# EAGLE design femtoBeacon_coin_nRF52832_BT4.2_r1.0.0 (EAGLE 7.5.0)

## Sheet 1 of 2
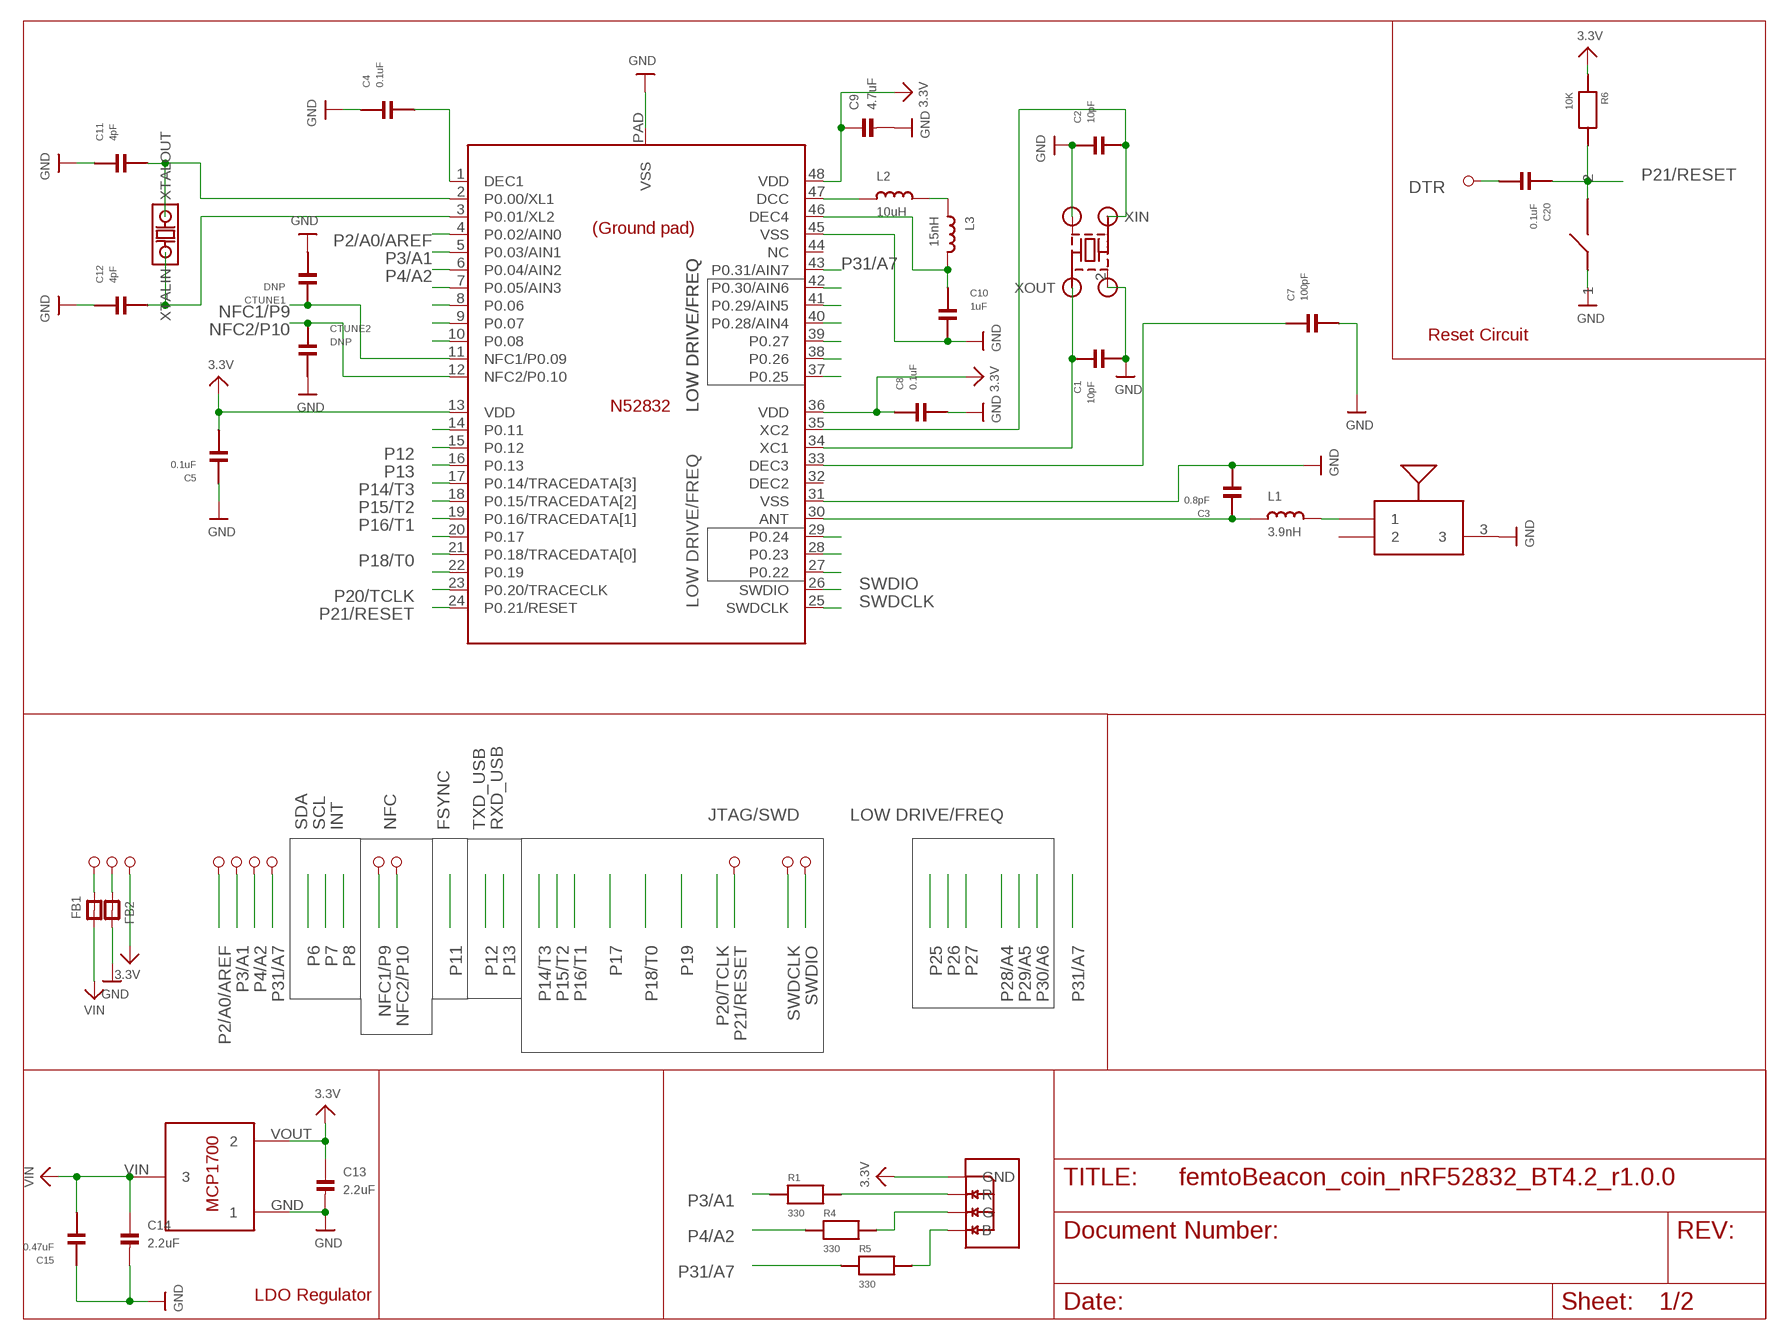
[diagram p0: schematic, sheet 1]

### Parts
ANTBAR  PULSE_ANT_2.4GHZ  [ANT_BAR]
C1  10pF  CAPACITOR_0201  [PART]
C2  10pF  CAPACITOR_0201  [PART]
C3  0.8pF  CAPACITOR_0201  [PART]
C4  0.1uF  CAPACITOR_0201  [PART]
C5  0.1uF  CAPACITOR_0201  [PART]
C7  100pF  CAPACITOR_0201  [PART]
C8  0.1uF  CAPACITOR_0201  [PART]
C9  4.7uF  CAP_CERAMIC_0402MP  [_0402MP]
C10  1uF  CAPACITOR_0201  [PART]
C11  4pF  CAPACITOR_0201  [PART]
C12  4pF  CAPACITOR_0201  [PART]
C13  2.2uF  CAP_CERAMIC_0402MP  [_0402MP]
C14  2.2uF  CAP_CERAMIC_0402MP  [_0402MP]
C15  0.47uF  CAPACITOR_0201  [PART]
C20  0.1uF  CAPACITOR_0201  [PART]
CTUNE1  DNP  CAPACITOR_0201  [PART]
CTUNE2  DNP  CAPACITOR_0201  [PART]
FB1  FERRITE_0603MP  [_0603MP]
FB2  FERRITE_0603MP  [_0603MP]
IC1  NRF52832_QFN48  [QFN48]
L1  3.9nH  INDUCTOR_0402MP  [_0402MP]
L2  10uH  INDUCTOR_0603MP  [_0603MP]
L3  15nH  INDUCTOR_0402MP  [_0402MP]
LDO_VREG  MCP1700T-3302E/TT  [MCP1700T-3302E/TT]
LED1  LRTB_R48G  [LRTB_R48G]
PIN1  1X1_ROUND  [1X1_ROUND]
PIN2  1X1_ROUND  [1X1_ROUND]
PIN3  1X1_ROUND  [1X1_ROUND]
PIN4  1X1_ROUND  [1X1_ROUND]
PIN7  1X1_ROUND  [1X1_ROUND]
PIN8  1X1_ROUND  [1X1_ROUND]
PIN9  1X1_ROUND  [1X1_ROUND]
PIN10  1X1_ROUND  [1X1_ROUND]
PIN13  1X1_ROUND  [1X1_ROUND]
PIN14  1X1_ROUND  [1X1_ROUND]
PIN25  1X1_ROUND  [1X1_ROUND]
PIN26  1X1_ROUND  [1X1_ROUND]
PIN27  1X1_ROUND  [1X1_ROUND]
R1  330  RESISTOR_0201  [PART]
R4  330  RESISTOR_0201  [PART]
R5  330  RESISTOR_0201  [PART]
R6  10K  RESISTOR_0201  [PART]
RESET_JMP  SPST_SMD  [SPST_SMD]
XOSC32K  ABS06-107-32.768KHZ-T  [ABS06-107-32.768KHZ-T]
XTAL  32MHz  ABM11-48.000MHZ-D2X-T3  [ABM11]

### Nets
3.3V: C5.2 C8.1 C9.1 C13.1 IC1.13(VDD) IC1.36(VDD) IC1.48(VDD) LDO_VREG.VOUT LED1.1(GND) PIN3.P$1 R6.1 ; also sheet 2
B: LED1.4(B) R5.2
DTR: C20.2 PIN4.P$1
G: LED1.3(G) R4.2
GND: ANTBAR.3 C1.2 C2.1 C3.2 C4.1 C5.1 C7.2 C8.2 C9.2 C10.2 C11.1 C12.1 C13.2 C14.2 C15.1 CTUNE1.2 CTUNE2.2 FB2.2 IC1.31(VSS) IC1.45(VSS) IC1.PAD(VSS) LDO_VREG.GND RESET_JMP.1 XTAL.2(GND) XTAL.4(GND) ; also sheet 2
N$1: C4.2 IC1.1(DEC1)
N$2: L2.2 L3.1
N$3: IC1.47(DCC) L2.1
N$4: C7.1 IC1.33(DEC3)
N$5: FB2.1 PIN2.P$1
N$6: C10.1 IC1.46(DEC4) L3.2
N$8: FB1.2 PIN1.P$1
N$13: C3.1 IC1.30(ANT) L1.1
NFC1/P9: CTUNE1.1 IC1.11(NFC1/P0.09) PIN13.P$1
NFC2/P10: CTUNE2.1 IC1.12(NFC2/P0.10) PIN14.P$1
P0/XIN32: C11.2 IC1.2(P0.00/XL1) XOSC32K.2(XTALOUT)
P1/XOUT32: C12.2 IC1.3(P0.01/XL2) XOSC32K.1(XTALIN)
P2/A0/AREF: IC1.4(P0.02/AIN0) PIN9.P$1
P3/A1: IC1.5(P0.03/AIN1) PIN10.P$1 R1.1
P4/A2: IC1.6(P0.04/AIN2) PIN7.P$1 R4.1
P5/A3: IC1.7(P0.05/AIN3)
P6: IC1.8(P0.06) ; also sheet 2
P7: IC1.9(P0.07) ; also sheet 2
P8: IC1.10(P0.08) ; also sheet 2
P11: IC1.14(P0.11) ; also sheet 2
P12: IC1.15(P0.12)
P13: IC1.16(P0.13)
P14/T3: IC1.17(P0.14/TRACEDATA[3])
P15/T2: IC1.18(P0.15/TRACEDATA[2])
P16/T1: IC1.19(P0.16/TRACEDATA[1])
P17: IC1.20(P0.17)
P18/T0: IC1.21(P0.18/TRACEDATA[0])
P19: IC1.22(P0.19)
P20/TCLK: IC1.23(P0.20/TRACECLK)
P21/RESET: C20.1 IC1.24(P0.21/RESET) PIN25.P$1 R6.2 RESET_JMP.2
P22: IC1.27(P0.22)
P23: IC1.28(P0.23)
P24: IC1.29(P0.24)
P25: IC1.37(P0.25)
P26: IC1.38(P0.26)
P27: IC1.39(P0.27)
P28/A4: IC1.40(P0.28/AIN4)
P29/A5: IC1.41(P0.29/AIN5)
P30/A6: IC1.42(P0.30/AIN6)
P31/A7: IC1.43(P0.31/AIN7) PIN8.P$1 R5.1
R: LED1.2(R) R1.2
RF: ANTBAR.1 L1.2
SWDCLK: IC1.25(SWDCLK) PIN26.P$1
SWDIO: IC1.26(SWDIO) PIN27.P$1
VIN: C14.1 C15.2 FB1.1 LDO_VREG.VIN
XIN: C1.1 IC1.34(XC1) XTAL.3(XOUT)
XOUT: C2.2 IC1.35(XC2) XTAL.1(XIN)
Unconnected: ANTBAR.2 IC1.32(DEC2) IC1.44(NC)

### Notes on the sheet
- Reset Circuit
- LOW DRIVE/FREQ | LOW DRIVE/FREQ
- LOW DRIVE/FREQ
- JTAG/SWD | LOW DRIVE/FREQ
- SDA | SCL | INT | NFC | FSYNC | TXD_USB | RXD_USB
- LDO Regulator

## Sheet 2 of 2
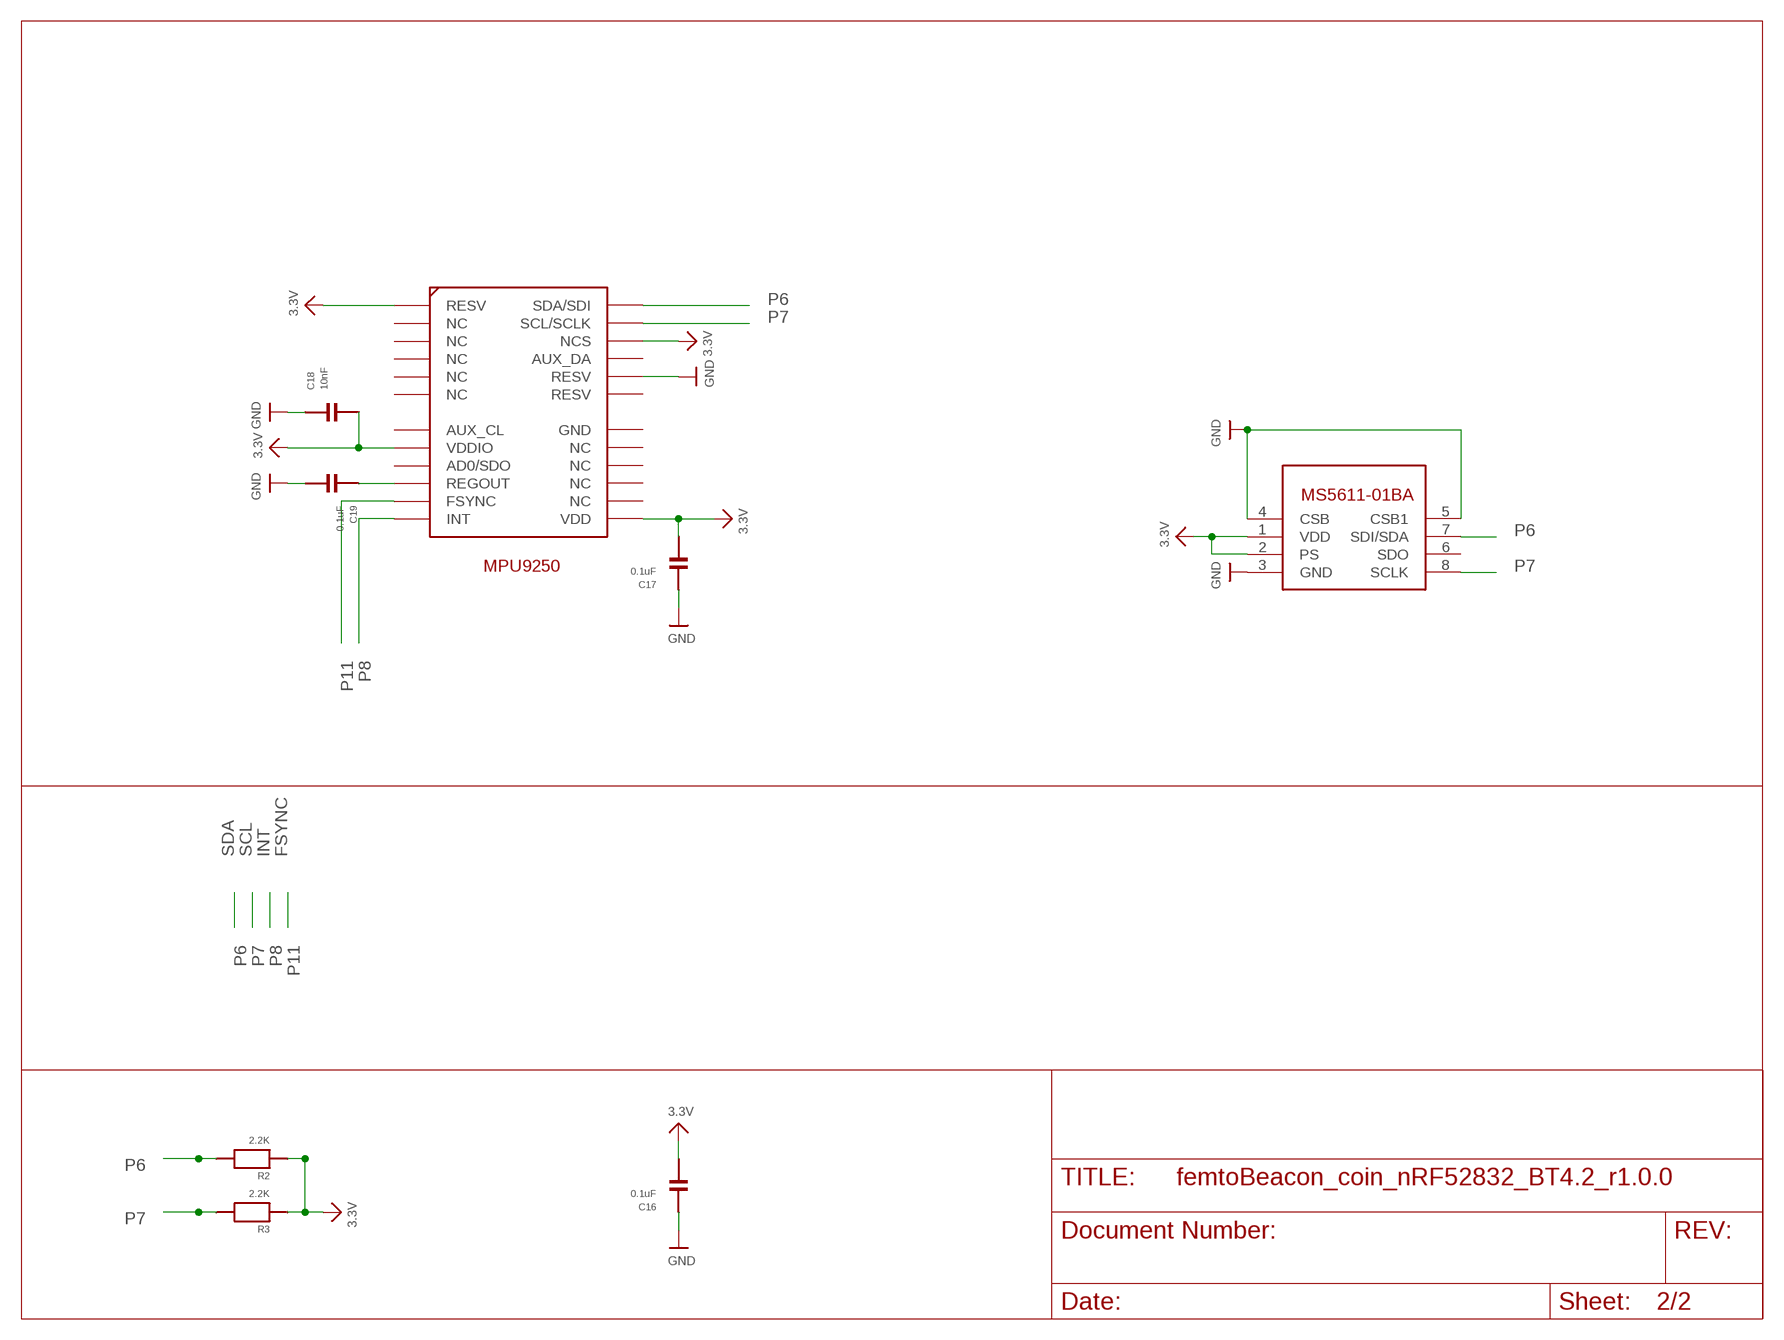
[diagram p1: schematic, sheet 2]

### Parts
BARO1  MS5611-01BA03  [MS5611-01BA03]
C16  0.1uF  CAPACITOR_0201  [PART]
C17  0.1uF  CAPACITOR_0201  [PART]
C18  10nF  CAPACITOR_0201  [PART]
C19  0.1uF  CAPACITOR_0201  [PART]
IMU1  MPU-9250  [QFN_3X3MM]
R2  2.2K  RESISTOR_0201  [PART]
R3  2.2K  RESISTOR_0201  [PART]

### Nets
3.3V: BARO1.1(VDD) BARO1.2(PS) C16.2 C17.2 C18.2 IMU1.P$1(RESV) IMU1.P$8(VDDIO) IMU1.P$13(VDD) IMU1.P$22(NCS) R2.1 R3.1 ; also sheet 1
GND: BARO1.3(GND) BARO1.4(CSB) BARO1.5(CSB1) C16.1 C17.1 C18.1 C19.2 IMU1.P$20(RESV) ; also sheet 1
P6: BARO1.7(SDI/SDA) IMU1.P$24(SDA/SDI) R2.2 ; also sheet 1
P7: BARO1.8(SCLK) IMU1.P$23(SCL/SCLK) R3.2 ; also sheet 1
P8: IMU1.P$12(INT) ; also sheet 1
P11: IMU1.P$11(FSYNC) ; also sheet 1
REGOUT: C19.1 IMU1.P$10(REGOUT)
Unconnected: BARO1.6(SDO) IMU1.P$2(NC) IMU1.P$3(NC) IMU1.P$4(NC) IMU1.P$5(NC) IMU1.P$6(NC) IMU1.P$7(AUX_CL) IMU1.P$9(AD0/SDO) IMU1.P$14(NC) IMU1.P$15(NC) IMU1.P$16(NC) IMU1.P$17(NC) IMU1.P$18(GND) IMU1.P$19(RESV) IMU1.P$21(AUX_DA)

### Notes on the sheet
- MPU9250
- SDA | SCL | INT | FSYNC

## Library data of the parts
ANTBAR = bar_antenna:PULSE_ANT_2.4GHZ: Manufacturer part #W3008; MFR_ID: W3008
BARO1 = freeimu:MS5611-01BA03; MFR_ID: MS561101BA03-50
C1 C2 = parts_0201:CAPACITOR_0201; MFR_ID: GRM0335C1E100GA01D; TOL: NP0, 2%
C3 = parts_0201:CAPACITOR_0201; MFR_ID: GJM0335C1ER80BB01D; TOL: NP0, 5%
C4 C5 C8 C16 C17 C19 C20 = parts_0201:CAPACITOR_0201; MFR_ID: GRM033C80J104KE84D
C7 = parts_0201:CAPACITOR_0201; MFR_ID: C0201C101J3GACTU; TOL: NP0, 5%
C9 = microbuilder:CAP_CERAMIC: Ceramic Capacitors 0402 - 0402 Surface Mount Capacitors 16pF 50V 5% [Digikey: 445-4899-2-ND] 18pF 50V 5% [Digikey: 490-1281-2-ND] 22pF 50V 5% [Digikey: 490-1283-2-ND] 68pF 50V 5% [Digikey: 490-1289-2-ND] 0.1uF 10V 10% [Digikey: 490-1318-2-ND] 1.0uF 6.3V 10% [Digikey: 490-1320-2-ND] 0603 - 0603 Surface Mount Capacitors 16 pF 50V 5% [Digikey: 445-5051-2-ND] 22 pF 50V [Digikey: PCC220ACVTR-ND] 33 pF 50V 5% [Digikey: 490-1415-1-ND] 56pF 50V 5% [Digikey: 490-1421-1-ND] 220pF 50V 5% [Digikey: 445-1285-1-ND] 680 pF 50V 2200 pF 50V 5% C0G [Digikey: 445-1297-1-ND] 5600 pF 100V 5% X7R [Digikey: 478-3711-1-ND] 0.1 µF 25V 10% [Digikey: PCC2277TR-ND] 0.22 µF 16V 10% X7R [Digikey: 445-1318-1-ND] 1.0 µF 25V 10% [Digikey: 445-5146-2-ND] 0603 - RF Specific 3pF 250V +/-0.1pF RF [Digikey: 712-1347-1-ND] 18 pF 250V 5% [Digikey: 478-3505-1-ND or 712-1322-1-ND] 56 pF 250V 5% C0G RF [Digikey: 490-4867-1-ND] 68 pF 250V RF [Digikey: 490-4868-1-ND] 0805 - 0805 Surface Mount Capacitors 220 pF 250V 2% RF Ceramic Capacitor [Digikey: 712-1398-1-ND] 1000 pF 50V 2% NP0 Ceramic Capacitor [Digikey: 478-3760-1-ND] 0.1 µF 25V 10% Ceramic Capacitor [Digikey: PCC1828TR-ND] 1.0 µF 16V 10% Ceramic Capacitor[Digikey: 490-1691-2-ND] 10.0 µF 10V 10% Ceramic Capacitor[Digikey: 709-1228-1-ND] 10.0 uF 16V 10% Ceramic Capacitor [Digikey: 478-5165-2-ND] 47 uF 6.3V 20% Ceramic Capacitor [Digikey: 587-1779-1-ND or 399-5506-1-ND] 1206 - 1206 Surface Mount Capacitors 47uF 10V 20% Ceramic Capacitor [Digikey: 490-5528-1-ND or 399-5508-1-ND or 445-6010-1-ND] 100uF 6.3V -20%, +80% Y5V Ceramic Capacitor (Digikey: 490-4512-1-ND, Mouser: 81-GRM31CF50J107ZE1L); MFR_ID: C1005X5R1A475K050BC; TOL: X5R, 10%
C10 = parts_0201:CAPACITOR_0201; MFR_ID: 02016D105KAT2A; TOL: X7R, 10%
C11 C12 = parts_0201:CAPACITOR_0201; MFR_ID: GRM0335C1H4R0BA01D; TOL: NP0, 2%
C13 C14 = microbuilder:CAP_CERAMIC: Ceramic Capacitors 0402 - 0402 Surface Mount Capacitors 16pF 50V 5% [Digikey: 445-4899-2-ND] 18pF 50V 5% [Digikey: 490-1281-2-ND] 22pF 50V 5% [Digikey: 490-1283-2-ND] 68pF 50V 5% [Digikey: 490-1289-2-ND] 0.1uF 10V 10% [Digikey: 490-1318-2-ND] 1.0uF 6.3V 10% [Digikey: 490-1320-2-ND] 0603 - 0603 Surface Mount Capacitors 16 pF 50V 5% [Digikey: 445-5051-2-ND] 22 pF 50V [Digikey: PCC220ACVTR-ND] 33 pF 50V 5% [Digikey: 490-1415-1-ND] 56pF 50V 5% [Digikey: 490-1421-1-ND] 220pF 50V 5% [Digikey: 445-1285-1-ND] 680 pF 50V 2200 pF 50V 5% C0G [Digikey: 445-1297-1-ND] 5600 pF 100V 5% X7R [Digikey: 478-3711-1-ND] 0.1 µF 25V 10% [Digikey: PCC2277TR-ND] 0.22 µF 16V 10% X7R [Digikey: 445-1318-1-ND] 1.0 µF 25V 10% [Digikey: 445-5146-2-ND] 0603 - RF Specific 3pF 250V +/-0.1pF RF [Digikey: 712-1347-1-ND] 18 pF 250V 5% [Digikey: 478-3505-1-ND or 712-1322-1-ND] 56 pF 250V 5% C0G RF [Digikey: 490-4867-1-ND] 68 pF 250V RF [Digikey: 490-4868-1-ND] 0805 - 0805 Surface Mount Capacitors 220 pF 250V 2% RF Ceramic Capacitor [Digikey: 712-1398-1-ND] 1000 pF 50V 2% NP0 Ceramic Capacitor [Digikey: 478-3760-1-ND] 0.1 µF 25V 10% Ceramic Capacitor [Digikey: PCC1828TR-ND] 1.0 µF 16V 10% Ceramic Capacitor[Digikey: 490-1691-2-ND] 10.0 µF 10V 10% Ceramic Capacitor[Digikey: 709-1228-1-ND] 10.0 uF 16V 10% Ceramic Capacitor [Digikey: 478-5165-2-ND] 47 uF 6.3V 20% Ceramic Capacitor [Digikey: 587-1779-1-ND or 399-5506-1-ND] 1206 - 1206 Surface Mount Capacitors 47uF 10V 20% Ceramic Capacitor [Digikey: 490-5528-1-ND or 399-5508-1-ND or 445-6010-1-ND] 100uF 6.3V -20%, +80% Y5V Ceramic Capacitor (Digikey: 490-4512-1-ND, Mouser: 81-GRM31CF50J107ZE1L); MFR_ID: C1005X5R1A225K050BC
C15 = parts_0201:CAPACITOR_0201; MFR_ID: C0603X5R0J474K030BC
C18 = parts_0201:CAPACITOR_0201; MFR_ID: GRM033R71A103KA01D
CTUNE1 CTUNE2 = parts_0201:CAPACITOR_0201
FB1 FB2 = microbuilder:FERRITE: Ferrite Bead 0603 MMZ1608B121C - 120 Ohm @ 100MHz, 600mA, 0.15 Ohm DC Resistance - Digikey: 445-2164-1-ND BK1608HW121-T - 120 Ohm, 600mA Ferrite Chip - Digikey: 587-1876-2-ND 0805 HZ0805B272R-10 - 2.7K Ohm @ 100MHz, 200mA, 0.8 Ohm DC Resistance - Digikey: 240-2504-1-ND (see also Murata BLM21BD272SN1L) MMZ2012Y152B - 1.5K Ohm @ 100MHz, 500mA, 0.4 Ohm DC Resistance - Digikey: 445-1560-1-ND - Mainly for high frequency (80-400MHz) MMZ2012R102A - 1K Ohm @ 100MHz, 500mA, 0.3 Ohm DC Resistance - Digikey: 445-1555-2-ND - More general purpose (10-200MHz); MFR_ID: BLM18RK102SN1D
IC1 = nordic-nrf52832:NRF52832_QFN48: Nordic nRF52832 QFN48 chip (6mm x 6mm). Supports BT 4.2, NFC, iPv6; MFR_ID: NRF52832-QFAA-R
IMU1 = mpu9250:MPU-9250; MFR_ID: MPU-9250
L1 = microbuilder:INDUCTOR: Inductors 0603: 10nH Ceramic Inductor - microwire antenna/RF (Digikey: 712-1434-2-ND) 0805: 560nH Ceramic Inductor - RF (Digikey: 553-1047-1-ND) 270nH Ceramic Inductor - Q = 40@250MHz, +-5%, 1 Ohm DC Resistance (Digikey: 535-10506-2-ND) 1007 (2518 Metric) SMT: 10µH 10% 250mOhm 820mA 1007 Inductor (Digikey: 587-2189-1-ND) 22µH 10% 500mOhm 580mA 1007 Inductor (Digikey: 587-2190-1-ND) 47µH 10% 950mOhm 420mA 1007 Inductor (Digikey: 587-2191-1-ND) 47µH 5% 100mOhm 1A 1008 Inductor (Digikey: 732-1816-1-ND) 5.0x5.0mm (Taiyo Yuden NR5040 Series) 6.8µH 20% 2.3A 64mOhm Inductor (Digikey: 587-2374-2-ND) 5.0x5.0mm (TDK VLC5045 Series) 4.7µH 20% 3.3A 34mOhm Inductor (Digikey: 445-6526-1-ND) 6.8µH 20% 2.7A 46mOhm Inductor (Digikey: 445-6527-1-ND) 6.0x6.0mm (TDK VLC6045 Series) 4.7µH 20% 3.8A 27mOhm Inductor (Digikey: 445-6538-2-ND) 6.8µH 20% 3A 41mOhm Inductor (Digikey: 445-6540-1-ND) 6.2µH 30% 2.2A 45mOhm Inductor (Digikey: SRR5028-6R2YCT-ND) - Not TDK VLC6045 but footprint should match 6.0x6.0mm (TDK SLF6045 Series) 6.8uH 30% 2A 33mOhm Inductor (Digikey: 445-4572-1-ND, Mouser: 810-SLF645T6R8N2R0PF); MFR_ID: 744765039A; TOL: HF Chip 5%
L2 = microbuilder:INDUCTOR: Inductors 0603: 10nH Ceramic Inductor - microwire antenna/RF (Digikey: 712-1434-2-ND) 0805: 560nH Ceramic Inductor - RF (Digikey: 553-1047-1-ND) 270nH Ceramic Inductor - Q = 40@250MHz, +-5%, 1 Ohm DC Resistance (Digikey: 535-10506-2-ND) 1007 (2518 Metric) SMT: 10µH 10% 250mOhm 820mA 1007 Inductor (Digikey: 587-2189-1-ND) 22µH 10% 500mOhm 580mA 1007 Inductor (Digikey: 587-2190-1-ND) 47µH 10% 950mOhm 420mA 1007 Inductor (Digikey: 587-2191-1-ND) 47µH 5% 100mOhm 1A 1008 Inductor (Digikey: 732-1816-1-ND) 5.0x5.0mm (Taiyo Yuden NR5040 Series) 6.8µH 20% 2.3A 64mOhm Inductor (Digikey: 587-2374-2-ND) 5.0x5.0mm (TDK VLC5045 Series) 4.7µH 20% 3.3A 34mOhm Inductor (Digikey: 445-6526-1-ND) 6.8µH 20% 2.7A 46mOhm Inductor (Digikey: 445-6527-1-ND) 6.0x6.0mm (TDK VLC6045 Series) 4.7µH 20% 3.8A 27mOhm Inductor (Digikey: 445-6538-2-ND) 6.8µH 20% 3A 41mOhm Inductor (Digikey: 445-6540-1-ND) 6.2µH 30% 2.2A 45mOhm Inductor (Digikey: SRR5028-6R2YCT-ND) - Not TDK VLC6045 but footprint should match 6.0x6.0mm (TDK SLF6045 Series) 6.8uH 30% 2A 33mOhm Inductor (Digikey: 445-4572-1-ND, Mouser: 810-SLF645T6R8N2R0PF); MFR_ID: LQM18FN100M00D; TOL: Chip, IDC min 50mA 20%
L3 = microbuilder:INDUCTOR: Inductors 0603: 10nH Ceramic Inductor - microwire antenna/RF (Digikey: 712-1434-2-ND) 0805: 560nH Ceramic Inductor - RF (Digikey: 553-1047-1-ND) 270nH Ceramic Inductor - Q = 40@250MHz, +-5%, 1 Ohm DC Resistance (Digikey: 535-10506-2-ND) 1007 (2518 Metric) SMT: 10µH 10% 250mOhm 820mA 1007 Inductor (Digikey: 587-2189-1-ND) 22µH 10% 500mOhm 580mA 1007 Inductor (Digikey: 587-2190-1-ND) 47µH 10% 950mOhm 420mA 1007 Inductor (Digikey: 587-2191-1-ND) 47µH 5% 100mOhm 1A 1008 Inductor (Digikey: 732-1816-1-ND) 5.0x5.0mm (Taiyo Yuden NR5040 Series) 6.8µH 20% 2.3A 64mOhm Inductor (Digikey: 587-2374-2-ND) 5.0x5.0mm (TDK VLC5045 Series) 4.7µH 20% 3.3A 34mOhm Inductor (Digikey: 445-6526-1-ND) 6.8µH 20% 2.7A 46mOhm Inductor (Digikey: 445-6527-1-ND) 6.0x6.0mm (TDK VLC6045 Series) 4.7µH 20% 3.8A 27mOhm Inductor (Digikey: 445-6538-2-ND) 6.8µH 20% 3A 41mOhm Inductor (Digikey: 445-6540-1-ND) 6.2µH 30% 2.2A 45mOhm Inductor (Digikey: SRR5028-6R2YCT-ND) - Not TDK VLC6045 but footprint should match 6.0x6.0mm (TDK SLF6045 Series) 6.8uH 30% 2A 33mOhm Inductor (Digikey: 445-4572-1-ND, Mouser: 810-SLF645T6R8N2R0PF); MFR_ID: LQW15AN15NH00D; TOL: HF Chip 10%
LDO_VREG = MCP1700T-3302E_TT:MCP1700T-3302E/TT: Microchip LDO "MCP1700" in a 3-Pin SOT-23 package. ID: MCP1700T-3302E/TT; MFR_ID: MCP1700T-3302E/TT
LED1 = osram_opto_LED:LRTB_R48G; MFR_ID: LRTB R48G
PIN1-PIN4 PIN7-PIN10 PIN13 PIN14 PIN25-PIN27 = pins_1.27mm_pitch:1X1_ROUND
R1 R4 R5 = parts_0201:RESISTOR_0201; MFR_ID: CRCW0201330RJNED
R2 R3 = parts_0201:RESISTOR_0201; MFR_ID: CRCW02012K20JNED
R6 = parts_0201:RESISTOR_0201; MFR_ID: CRCW020110K0FNED
RESET_JMP = femtoduino:SPST_SMD
XOSC32K = crystals:ABS06-107-32.768KHZ-T: ABS06-107-32.768kHz-T Crystal Oscillator; MFR_ID: ABS06-107-32.768kHz-T
XTAL = crystals:ABM11-48.000MHZ-D2X-T3: Mouser part 815-ABM11-48-D2XT3 Abracon 48MHz crystal; MFR_ID: ABM11-32.000MHZ-B7G-T

## Board
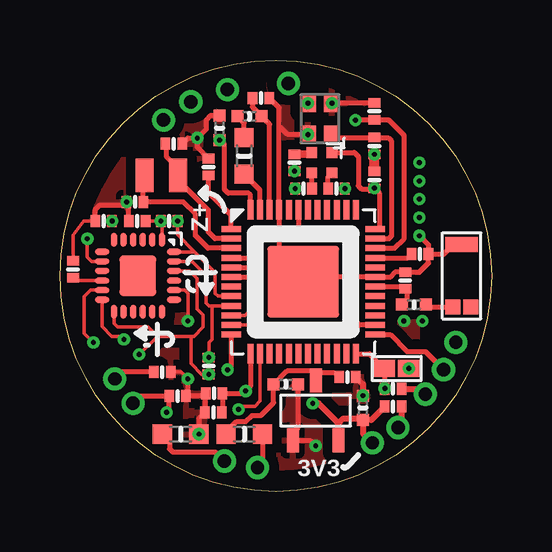
[diagram p2: board, top side]
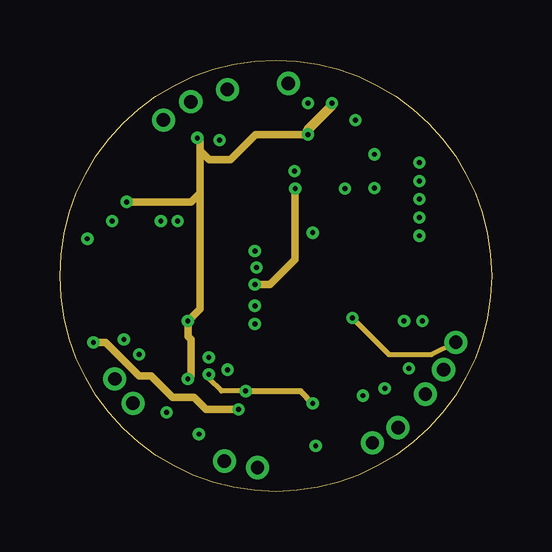
[diagram p3: board, inner layer Route2]
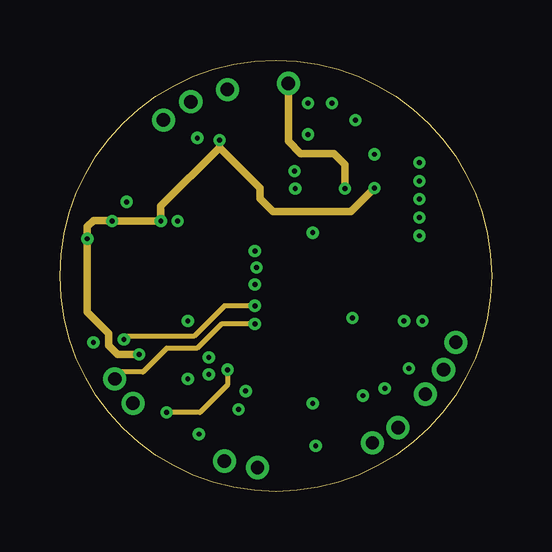
[diagram p4: board, inner layer Route15]
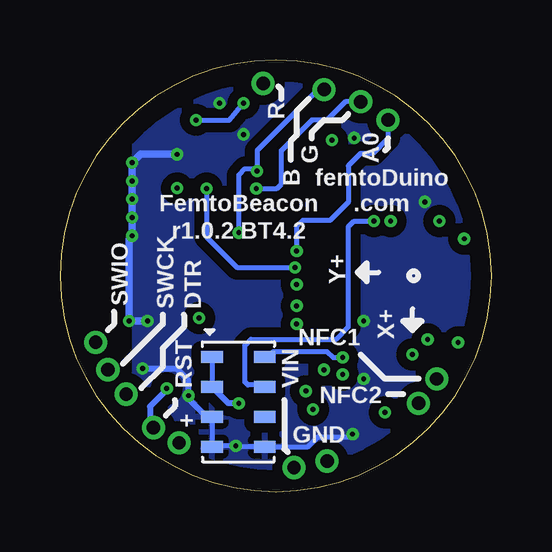
[diagram p5: board, bottom side, seen from below]

Size 18 x 18 mm. Coordinates in mm from the lower left corner, seen from the top.
Outline: 0,9 arc-180 18,9 arc-180 0,9
Copper layers (1+2*15+16): Top 0.035mm / dielectric 1.5mm / Route2 0.035mm / dielectric 0.15mm / Route15 0.035mm / dielectric 0.2mm / Bottom 0.035mm
Design rules "femtoduino_5mil_4layer": minimum track width 5mil, minimum drill 5mil, track to track 5mil, track to pad 5mil, pad to pad 5mil, via to via 5mil, smd to smd 5mil, copper to edge 5mil, drill to drill 5mil, minimum pad ring 8mil, minimum via ring 5mil, stop-mask expansion 2mil, vias tented up to drill 30mil, thermal gap 10mil

### Footprints (pad centres in the part's own frame; a part is rotated, then mirrored left to right if it is on the bottom)
ANT_BAR = smd 0.62 x 0.61: 1 -1.3,0.37; 2 -1.3,-0.38 | smd 0.62 x 1.36: 3 1.3,0
MS5611-01BA03 = smd 0.9 x 0.5: 1 -1.1,1.875; 2 -1.1,0.625; 3 -1.1,-0.625; 4 -1.1,-1.875; 5 1.1,-1.875; 6 1.1,-0.625; 7 1.1,0.625; 8 1.1,1.875
PART = smd 0.4 x 0.5: 1 -0.35,0; 2 0.35,0
_0402MP = smd 0.5 x 0.5: 1 -0.508,0; 2 0.508,0
_0603MP = smd 0.8 x 0.8: 1 -0.762,0; 2 0.762,0
QFN48 = smd 0.8 x 0.25: 1 -3,2.2; 2 -3,1.8; 3 -3,1.4; 4 -3,1; 5 -3,0.6; 6 -3,0.2; 7 -3,-0.2; 8 -3,-0.6; 9 -3,-1; 10 -3,-1.4; 11 -3,-1.8; 12 -3,-2.2; 25 3,-2.2; 26 3,-1.8; 27 3,-1.4; 28 3,-1; 29 3,-0.6; 30 3,-0.2; 31 3,0.2; 32 3,0.6; 33 3,1; 34 3,1.4; 35 3,1.8; 36 3,2.2 | smd 0.25 x 0.8: 13 -2.2,-3; 14 -1.8,-3; 15 -1.4,-3; 16 -1,-3; 17 -0.6,-3; 18 -0.2,-3; 19 0.2,-3; 20 0.6,-3; 21 1,-3; 22 1.4,-3; 23 1.8,-3; 24 2.2,-3; 37 2.2,3; 38 1.8,3; 39 1.4,3; 40 1,3; 41 0.6,3; 42 0.2,3; 43 -0.2,3; 44 -0.6,3; 45 -1,3; 46 -1.4,3; 47 -1.8,3; 48 -2.2,3 | smd 3 x 3: PAD 0,0
QFN_3X3MM = smd 0.6 x 0.25: P$1 -1.5,1; P$2 -1.5,0.6; P$3 -1.5,0.2; P$4 -1.5,-0.2; P$5 -1.5,-0.6; P$6 -1.5,-1; P$13 1.5,-1; P$14 1.5,-0.6; P$15 1.5,-0.2; P$16 1.5,0.2; P$17 1.5,0.6; P$18 1.5,1 | smd 0.25 x 0.6: P$7 -1,-1.5; P$8 -0.6,-1.5; P$9 -0.2,-1.5; P$10 0.2,-1.5; P$11 0.6,-1.5; P$12 1,-1.5; P$19 1,1.5; P$20 0.6,1.5; P$21 0.2,1.5; P$22 -0.2,1.5; P$23 -0.6,1.5; P$24 -1,1.5 | smd 1.7 x 1.54: P$25 0,0
MCP1700T-3302E/TT = smd 0.5 x 1: GND -0.95,-1.25; VIN 0,1.25; VOUT 0.95,-1.25
LRTB_R48G = smd 0.45 x 0.45: 1 0.425,0.425; 2 0.425,-0.425; 3 -0.425,-0.425; 4 -0.425,0.425
1X1_ROUND = drill 0.559 pad 0.864: P$1 0,0
SPST_SMD = smd 0.889 x 0.699: 1 -0.508,0; 2 0.508,0
ABS06-107-32.768KHZ-T = smd 0.75 x 1.4: 1 -0.7,0; 2 0.7,0
ABM11 = smd 0.75 x 0.65: 1 -0.65,-0.5; 2 0.65,-0.5; 3 0.65,0.5; 4 -0.65,0.5

### Placement (x,y rotation side)
ANTBAR  16.75,9 90 top
BARO1  10.56,3.75 0 bottom
C1  13.11,15.86 90 top
C2  13.11,14.41 90 top
C3  14.4,8.8 90 top
C4  6.2,13.54 270 top
C5  6.43,4.1 0 top
C7  15.02,9.9 0 top
C8  13.11,13 90 top
C9  6.66,15.16 90 top
C10  8.38,16.41 0 top
C11  4.75,14.5 180 top
C12  3.13,12.08 0 top
C13  12.64,3.49 90 top
C14  9.42,4.47 0 top
C15  11.99,4.78 180 top
C16  6.4,3.3 0 top
C17  3.22,11.28 0 top
C18  1.82,11.28 0 top
C19  0.54,9.27 90 top
C20  13.89,4.29 0 top
CTUNE1  4.27,4.98 0 top
CTUNE2  4.91,3.98 0 top
FB1  7.69,2.39 0 top
FB2  5.03,2.39 0 top
IC1  10.14,8.75 0 top
IMU1  3.25,9 270 top
L1  14.76,7.79 0 top
L2  7.68,14 90 top
L3  7.91,15.65 0 top
LDO_VREG  10.67,3.38 0 top
LED1  10.92,13.72 0 top
PIN1  8.24,1 0 top
PIN2  6.86,1.27 0 top
PIN3  13.03,2.03 0 top
PIN4  15.24,4.06 0 top
PIN7  5.46,16.26 0 top
PIN8  6.99,16.76 0 top
PIN9  4.32,15.49 0 top
PIN10  9.53,17.02 0 top
PIN13  2.29,4.7 0 top
PIN14  3.05,3.68 0 top
PIN25  14.1,2.67 0 top
PIN26  16,5.08 0 top
PIN27  16.51,6.22 0 top
R1  11.53,12.64 180 top
R2  4.56,11.28 0 top
R3  6.21,5.24 90 top
R4  10.16,12.64 0 top
R5  9.78,13.72 90 top
R6  13.89,3.54 0 top
RESET_JMP  14.04,5.13 180 top
XOSC32K  4.24,13.18 0 top
XTAL  10.85,15.54 90 top

### Tracks (layer width: path | path; a pad name or v marks a point on that pad's centre or on a via)
3.3V  (via drill 0.2 pad 0.51)
  Top 0.152: IMU1.P$22 5.41,9.2 5.71,8.89 5.71,7.62 5.97,7.37 5.97,6.86 5.59,6.48 5.46,6.48 | IMU1.P$1 4.25,11.23 R2.1 C17.2 | 5.46,6.48 4.06,6.48 | 4.06,6.48 3.68,6.86 2.41,6.86 2.25,7.02 IMU1.P$13 | IMU1.P$8 1.32,9.6 1.14,9.78 v1.14,10.54 | 5.46,6.48 5.46,5.33 5.91,4.89 R3.1 | v3.3,5.71 4.06,6.48
  Top 0.203: IC1.48 7.94,12.38 7.87,12.45 7.02,12.45 6.86,12.6 6.86,14.48 6.66,14.68 C9.1 | IC1.36 13.17,10.92 13.34,10.92 13.34,12.43 C8.1 13.08,12.62 12.57,12.62 12.45,12.75 12.45,13.97 12.28,14.14 LED1.1 | C16.2 6.78,3.33 C5.2 7.66,4.1 v7.75,4.19 7.94,4.39 IC1.13
  Top 0.254: LDO_VREG.VOUT 11.62,2.85 | 11.62,2.85 11.81,3.05 12.57,3.05 C13.1 | v10.54,3.68 10.79,3.68 11.62,2.85 | R6.1 12.98,2.98 C13.1 | C13.1 12.64,2.42 PIN3.P$1
  Route2 0.203: v7.75,4.19 6.73,4.19 6.22,4.7 6.22,4.87 R3.1
  Route2 0.254: v7.75,4.19 10.03,4.19 v10.54,3.68
  Route15 0.305: R2.1 C18.2 2.15,11.3 1.4,11.3 1.14,11.05 v1.14,10.54 1.14,7.49 2.03,6.6 2.03,6.1 2.41,5.71 v3.3,5.71 | 4.19,11.3 R2.1 | 6.65,14.35 C9.1 | 6.65,14.35 8.35,12.65 8.35,12.22 8.89,11.68 12.14,11.68 C8.1 | 6.65,14.35 4.21,11.9 R2.1
  Bottom 0.203: BARO1.1 BARO1.2
  Bottom 0.254: v10.54,3.68 10.97,3.68 BARO1.2
  other vias: 4.21,11.28 6.21,4.89 2.17,11.28 6.66,14.65 13.11,12.65
B
  Top 0.305: R5.2 10.42,14.07 LED1.4
DTR
  Top 0.254: C20.2 15.02,4.29 PIN4.P$1
G
  Top 0.203: R4.2 10.51,13.18
  Top 0.305: 10.51,13.18 LED1.3
GND  (via drill 0.2 pad 0.51)
  Top 0.152: IMU1.P$20 5.19,8.4 5.33,8.26 v5.33,7.11 | 1.47,11.25 C18.1 0.99,11.28 0.54,10.7 C19.2 | 2.76,12.06 C12.1 | v5.33,4.7 5.05,4.98 CTUNE1.2
  Top 0.203: 9.14,15.24 IC1.45 9.14,9.75 IC1.PAD 10.34,8.95 IC1.31 13.77,8.95 13.98,9.15 C3.2 14.99,9.15 15.37,9.52 C7.2 | 9.14,15.24 9.14,16 C10.2 | C7.2 15.37,9.78 15.37,10.29 v14.99,10.67 | C1.2 11.7,16.21 11.56,16.19 XTAL.2 | v5.33,4.7 5.33,4.06 CTUNE2.2 5.96,3.98 C5.1 6.08,3.33 C16.1 5.79,3.05 FB2.2 | v10.67,1.91 10.44,2.13 LDO_VREG.GND 9.72,2.45 9.93,2.66 C14.2 | C7.2 16,9.9 16.26,10.16 16.61,10.16 ANTBAR.3 | XTAL.4 9.49,14.89 9.14,15.24 | C18.1 1.47,11.76 1.65,11.94 2.63,11.94 C12.1 2.87,11.98 C17.1 | C4.1 5.73,14.36 v5.73,14.75 | C9.2 6.27,15.67 6.1,15.49 6.1,15.11 v5.73,14.75 | C11.1 5.34,14.75 v5.73,14.75
  Top 0.254: C15.1 12.64,4.48 C13.2
  Top 0.406: C8.2 C2.1
  Route2 0.305: 5.84,12.45 5.84,7.62 v5.33,7.11 5.33,6.48 5.46,6.35 5.46,4.83 v5.33,4.7 | 5.84,12.45 5.84,14.22 | 5.84,14.22 5.84,14.61 v5.73,14.75 | C12.1 5.48,12.08 5.84,12.45 | XTAL.4 8.16,14.89 7.11,13.84 6.22,13.84 5.84,14.22
  Route2 0.406: XTAL.2 11.32,16.07 10.35,15.09 XTAL.4
  Bottom 0.203: FB2.2 5.9,2.29 7.24,2.29 7.65,1.87 BARO1.5 10.63,1.87 v10.67,1.91 11.62,1.91 BARO1.4 BARO1.3
  Bottom 0.254: BARO1.3 11.88,3.12 12.64,3.87 C13.2 12.64,4.64 13.13,5.13 RESET_JMP.1
  Bottom 0.305: C2.1 14.64,14.06 v14.99,13.72 v14.99,12.95 v14.99,12.19 v14.99,11.43 v14.99,10.67 15.11,10.54 v15.11,7.11 v14.35,7.11
  other vias: 10.35,14.89 11.35,16.19 5.79,2.39 13.11,14.06 12.64,4 14.55,5.13 2.78,12.08
  pour Top (isolate 0.406): 1,9 arc90 9,1 arc90 17,9 arc90 9,17 arc90
  cutout Bottom: 18,18 15.13,18 15.13,-0.03 18,-0.03
  cutout Top (isolate 0.254): 7.87,11.05 7.87,6.48 12.45,6.48 12.45,11.05
  pour Bottom (isolate 0.406): 1,9 arc90 9,1 arc90 17,9 arc90 9,17 arc90
  cutout Top: 18,18 15.13,18 15.13,-0.03 18,-0.03
N$1
  Top 0.203: IC1.1 7.14,11.53 6.2,12.47 C4.2
N$2
  Top 0.203: L2.2 7.68,15.37 L3.1
N$3
  Top 0.203: IC1.47 8.34,12.58 L2.1
N$4
  Top 0.203: IC1.33 14.51,9.75 C7.1
N$5
  Top 0.203: FB2.1 4.34,2.39 4.57,2.16 4.57,1.78 4.7,1.65 6.48,1.65 PIN2.P$1
N$6
  Top 0.203: IC1.46 8.74,15.32 L3.2 8.03,16.03 C10.1
N$8
  Top 0.203: FB1.2 8.45,1.21 PIN1.P$1
N$13
  Top 0.203: IC1.30 14.17,8.55 C3.1 14.48,8.38 14.48,7.99 L1.1
NFC1/P9  (via drill 0.2 pad 0.51)
  Top 0.152: IC1.11 8.09,6.95 v8.13,6.99
  Top 0.203: CTUNE1.1 2.57,4.98 PIN13.P$1
  Route15 0.203: v8.13,6.99 6.73,6.99 5.71,5.97 4.45,5.97 3.46,4.98 2.57,4.98 PIN13.P$1
NFC2/P10  (via drill 0.2 pad 0.51)
  Top 0.203: IC1.12 7.14,5.24 v6.99,5.08 | v4.45,3.3 4.55,3.41 CTUNE2.1 3.35,3.98 PIN14.P$1
  Route15 0.203: v6.99,5.08 6.99,4.45 5.84,3.3 v4.45,3.3
P0/XIN32
  Top 0.203: IC1.2 6.46,10.55 6.19,10.82 6.19,11.72 5.06,12.84 XOSC32K.2 4.94,13.48 4.45,13.97 4.45,14.45 C11.2
P1/XOUT32
  Top 0.203: IC1.3 6.17,10.15 5.65,10.67 5.65,11.56 5.14,12.08 C12.2 3.48,13.1 XOSC32K.1
P2/A0/AREF  (via drill 0.2 pad 0.51)
  Top 0.203: IC1.4 7.84,9.75 v8.13,10.03
  Bottom 0.203: PIN9.P$1 4.32,14.73 4.95,14.1 5.46,14.1 5.97,13.59 5.97,12.06 6.73,11.3 7.87,11.3 8.13,11.05 v8.13,10.03
P3/A1  (via drill 0.2 pad 0.51)
  Top 0.203: IC1.5 v8.2,9.35
  Route15 0.305: PIN10.P$1 9.53,14.61 10.03,14.1 11.43,14.1 11.88,13.64 R1.1
  Bottom 0.203: R1.1 11.88,10.61 10.62,9.35 v8.2,9.35
  other vias: 11.88,12.64
P4/A2  (via drill 0.2 pad 0.51)
  Top 0.203: IC1.6 7.82,8.95 v8.13,8.64
  Route2 0.305: R4.1 9.81,9.68 8.76,8.64 v8.13,8.64
  Bottom 0.203: PIN7.P$1 6.1,16.26 6.86,15.49 7.49,15.49 8.76,14.22 8.76,12.83 8.95,12.64 R4.1
  other vias: 9.81,12.64
P6  (via drill 0.2 pad 0.51)
  Top 0.152: IC1.8 6.59,8.15 6.48,8.26 6.48,9.14 5.62,10 | IMU1.P$24 5.62,10 | 5.62,10 4.91,10.71 R2.2
  Bottom 0.203: BARO1.7 9.53,4.45 10.16,4.45 10.29,4.57 10.29,6.1 10.03,6.35 6.48,6.35 5.97,6.86 5.97,11.05 5.74,11.28 R2.2
  other vias: 4.91,11.28
P7  (via drill 0.2 pad 0.51)
  Top 0.152: IMU1.P$23 5.51,9.6 6.1,9.02 6.1,7.87 6.22,7.75 6.35,7.75 | 6.35,7.75 7.01,7.75 IC1.9 | 6.35,7.75 6.35,6.35 6.21,6.21 R3.2
  Bottom 0.203: BARO1.8 9.11,5.84 6.86,5.84 6.6,5.59 R3.2
  other vias: 6.21,5.59
P8  (via drill 0.2 pad 0.51)
  Top 0.152: IMU1.P$12 1.75,6.88 2.16,6.48 2.67,6.48 v2.67,6.35 | IC1.10 7.73,7.35 v8.13,7.75
  Route15 0.203: v8.13,7.75 6.86,7.75 5.59,6.48 2.67,6.48 v2.67,6.35
P11  (via drill 0.2 pad 0.51)
  Top 0.152: IMU1.P$11 1.29,8.4 1.02,8.13 1.02,6.6 v1.4,6.22 | v7.44,3.43 7.57,3.56 8.13,3.56 8.34,3.77 IC1.14
  Route2 0.305: v1.4,6.22 1.91,6.22 3.3,4.83 3.81,4.83 4.7,3.94 5.59,3.94 6.1,3.43 v7.44,3.43
P21/RESET  (via drill 0.2 pad 0.51)
  Top 0.203: IC1.24 12.91,5.75 RESET_JMP.2 13.54,5.24 v13.54,4.3 | v13.54,4.3 C20.1 13.53,4.32 v13.54,4.3
  Top 0.254: R6.2 14.24,2.81 PIN25.P$1
  Bottom 0.254: v13.54,4.3 13.54,4.25 R6.2 14.24,2.81 PIN25.P$1
P31/A7  (via drill 0.2 pad 0.51)
  Top 0.203: IC1.43 9.94,10.88 10.03,10.79 v10.54,10.79
  Bottom 0.203: v10.54,10.79 10.54,13.21 10.29,13.46 9.88,13.46 R5.1 9.78,14.22 7.24,16.76 PIN8.P$1
  other vias: 9.78,13.37
R
  Top 0.203: R1.2 11.18,13.13 LED1.2
REGOUT
  Top 0.152: IMU1.P$10 0.73,8.8 C19.1
RF
  Top 0.203: L1.2 15.14,7.7 ANTBAR.1
SWDCLK
  Top 0.203: IC1.25 13.77,6.55 14.47,5.84 15.24,5.84 PIN26.P$1
SWDIO  (via drill 0.2 pad 0.51)
  Top 0.203: IC1.26 12.48,6.95 v12.19,7.24
  Route2 0.203: v12.19,7.24 13.72,5.71 15.49,5.71 PIN27.P$1
VIN
  Top 0.203: FB1.1 6.93,2.48 7.37,2.92 7.75,2.92 8,3.17 8.38,3.17 8.91,3.7 C14.1 9.47,5.03 10.67,5.03 10.67,4.95 | C15.2 11.42,4.95 10.67,4.95 | 10.67,4.95 LDO_VREG.VIN
XIN  (via drill 0.2 pad 0.51)
  Top 0.203: IC1.34 13.96,10.15 14.35,10.54 14.35,14.86 13.7,15.51 C1.1 13.1,15.49 v12.32,15.49
  Bottom 0.203: v12.32,15.49 10.92,15.49 XTAL.3
  other vias: 10.35,16.19
XOUT
  Top 0.203: IC1.35 13.72,10.55 13.84,10.67 13.84,14.61 13.72,14.73 13.14,14.73 | 13.14,14.73 C2.2 | 13.14,14.73 11.38,14.73 XTAL.1

### Text on the board
tNames: Z+ | 3V3
bNames: R | A0 | G | femtoDuino / .com | B | FemtoBeacon | r1.0.2 BT4.2 | Y+ | DTR | SWCK | SWIO | X+ | NFC1 | NFC2 | VIN | RST | + | GND